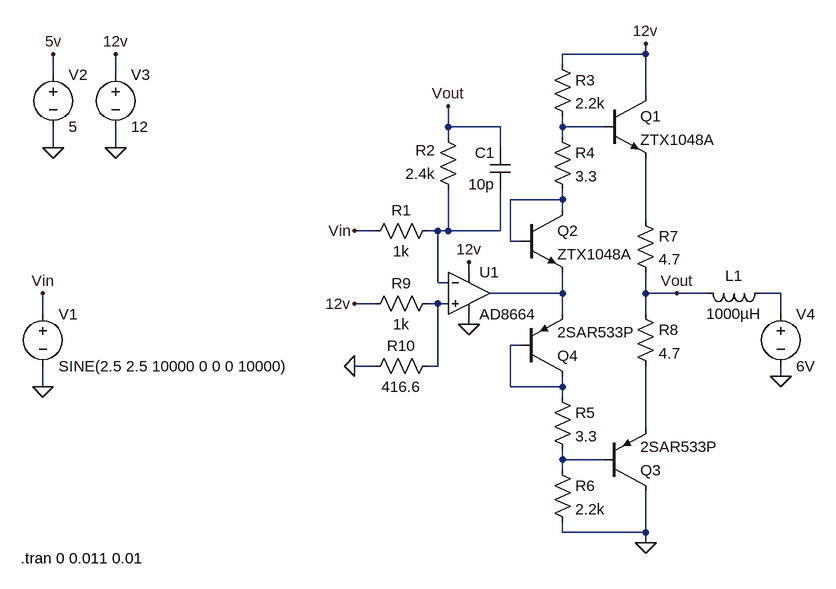
[diagram p0: schematic amplifier.asc]
amplifier.asc, the LTspice schematic file:
Version 4
SHEET 1 880 680
WIRE 496 -240 496 -256
WIRE 496 -240 368 -240
WIRE 368 -224 368 -240
WIRE -416 -208 -416 -240
WIRE -320 -208 -320 -240
WIRE 496 -176 496 -240
WIRE 192 -128 192 -160
WIRE 272 -128 192 -128
WIRE 368 -128 368 -144
WIRE 432 -128 368 -128
WIRE 192 -112 192 -128
WIRE 368 -112 368 -128
WIRE -416 -96 -416 -128
WIRE -320 -96 -320 -128
WIRE 272 -96 272 -128
WIRE 368 -16 368 -32
WIRE 368 -16 288 -16
WIRE 368 0 368 -16
WIRE 496 16 496 -80
WIRE 80 32 48 32
WIRE 176 32 160 32
WIRE 192 32 192 -32
WIRE 192 32 176 32
WIRE 272 32 272 -32
WIRE 272 32 192 32
WIRE 288 48 288 -16
WIRE 304 48 288 48
WIRE 224 96 224 80
WIRE 176 112 176 32
WIRE 192 112 176 112
WIRE 368 128 368 96
WIRE 368 128 256 128
WIRE 496 128 496 96
WIRE 544 128 496 128
WIRE 592 128 544 128
WIRE 704 128 672 128
WIRE 80 144 48 144
WIRE 176 144 160 144
WIRE 192 144 176 144
WIRE -432 160 -432 128
WIRE 368 160 368 128
WIRE 496 160 496 128
WIRE 704 160 704 128
WIRE 224 176 224 160
WIRE 304 208 288 208
WIRE 80 240 48 240
WIRE 176 240 176 144
WIRE 176 240 160 240
WIRE 704 256 704 240
WIRE -432 272 -432 240
WIRE 288 272 288 208
WIRE 368 272 368 256
WIRE 368 272 288 272
WIRE 368 288 368 272
WIRE 496 336 496 240
WIRE 368 384 368 368
WIRE 432 384 368 384
WIRE 368 400 368 384
WIRE 368 496 368 480
WIRE 496 496 496 432
WIRE 496 496 368 496
WIRE 496 512 496 496
FLAG -416 -96 0
FLAG -320 -96 0
FLAG -432 272 0
FLAG -432 128 Vin
FLAG 48 32 Vin
FLAG -416 -240 5v
FLAG -320 -240 12v
FLAG 224 80 12v
FLAG 48 240 0
FLAG 224 176 0
FLAG 496 512 0
FLAG 496 -256 12v
FLAG 544 128 Vout
FLAG 192 -160 Vout
FLAG 48 144 12v
FLAG 704 256 0
SYMBOL Opamps\\AD8664 224 64 R0
SYMATTR InstName U1
SYMBOL voltage -432 144 R0
WINDOW 123 0 0 Left 0
WINDOW 39 0 0 Left 0
SYMATTR InstName V1
SYMATTR Value SINE(2.5 2.5 10000 0 0 0 10000)
SYMBOL voltage -416 -224 R0
WINDOW 123 0 0 Left 0
WINDOW 39 0 0 Left 0
SYMATTR InstName V2
SYMATTR Value 5
SYMBOL voltage -320 -224 R0
WINDOW 123 0 0 Left 0
WINDOW 39 0 0 Left 0
SYMATTR InstName V3
SYMATTR Value 12
SYMBOL res 176 16 R90
WINDOW 0 0 56 VBottom 2
WINDOW 3 32 56 VTop 2
SYMATTR InstName R1
SYMATTR Value 1k
SYMBOL res 208 -16 R180
WINDOW 0 36 76 Left 2
WINDOW 3 36 40 Left 2
SYMATTR InstName R2
SYMATTR Value 2.4k
SYMBOL res 352 -240 R0
SYMATTR InstName R3
SYMATTR Value 2.2k
SYMBOL res 352 -128 R0
SYMATTR InstName R4
SYMATTR Value 3.3
SYMBOL res 352 272 R0
SYMATTR InstName R5
SYMATTR Value 3.3
SYMBOL res 352 384 R0
SYMATTR InstName R6
SYMATTR Value 2.2k
SYMBOL res 480 0 R0
SYMATTR InstName R7
SYMATTR Value 4.7
SYMBOL res 480 144 R0
SYMATTR InstName R8
SYMATTR Value 4.7
SYMBOL res 176 128 R90
WINDOW 0 0 56 VBottom 2
WINDOW 3 32 56 VTop 2
SYMATTR InstName R9
SYMATTR Value 1k
SYMBOL res 176 224 R90
WINDOW 0 0 56 VBottom 2
WINDOW 3 32 56 VTop 2
SYMATTR InstName R10
SYMATTR Value 416.6
SYMBOL cap 288 -32 R180
WINDOW 0 24 56 Left 2
WINDOW 3 24 8 Left 2
SYMATTR InstName C1
SYMATTR Value 10p
SYMBOL npn 432 -176 R0
SYMATTR InstName Q1
SYMATTR Value ZTX1048A
SYMBOL npn 304 0 R0
SYMATTR InstName Q2
SYMATTR Value ZTX1048A
SYMBOL pnp 432 432 M180
SYMATTR InstName Q3
SYMATTR Value 2SAR533P
SYMBOL pnp 304 256 M180
SYMATTR InstName Q4
SYMATTR Value 2SAR533P
SYMBOL ind 688 112 R90
WINDOW 0 5 56 VBottom 2
WINDOW 3 32 56 VTop 2
SYMATTR InstName L1
SYMATTR Value 1000µH
SYMBOL voltage 704 144 R0
WINDOW 123 0 0 Left 0
WINDOW 39 0 0 Left 0
SYMATTR InstName V4
SYMATTR Value 6V
TEXT -466 536 Left 2 !.tran 0 0.011 0.01

The netlist it stands for:
* amplifier.asc
XU1 N007 N004 12v 0 N005 AD8664  ; pins In+ In- V+ V- OUT
V1 Vin 0 SINE(2.5 2.5 10000 0 0 0 10000)
V2 5v 0 5
V3 12v 0 12
R1 N004 Vin 1k
R2 N004 Vout 2.4k
R3 12v N001 2.2k
R4 N001 N002 3.3
R5 N008 N010 3.3
R6 N010 0 2.2k
R7 N003 Vout 4.7
R8 Vout N009 4.7
R9 N007 12v 1k
R10 N007 0 416.6
C1 N004 Vout 10p
Q1 12v N001 N003 0 ZTX1048A
Q2 N002 N002 N005 0 ZTX1048A
Q3 0 N010 N009 0 2SAR533P
Q4 N008 N008 N005 0 2SAR533P
L1 N006 Vout 1000µH
V4 N006 0 6V
.model NPN NPN
.model PNP PNP
.lib standard.bjt
.tran 0 0.011 0.01
.backanno
.end